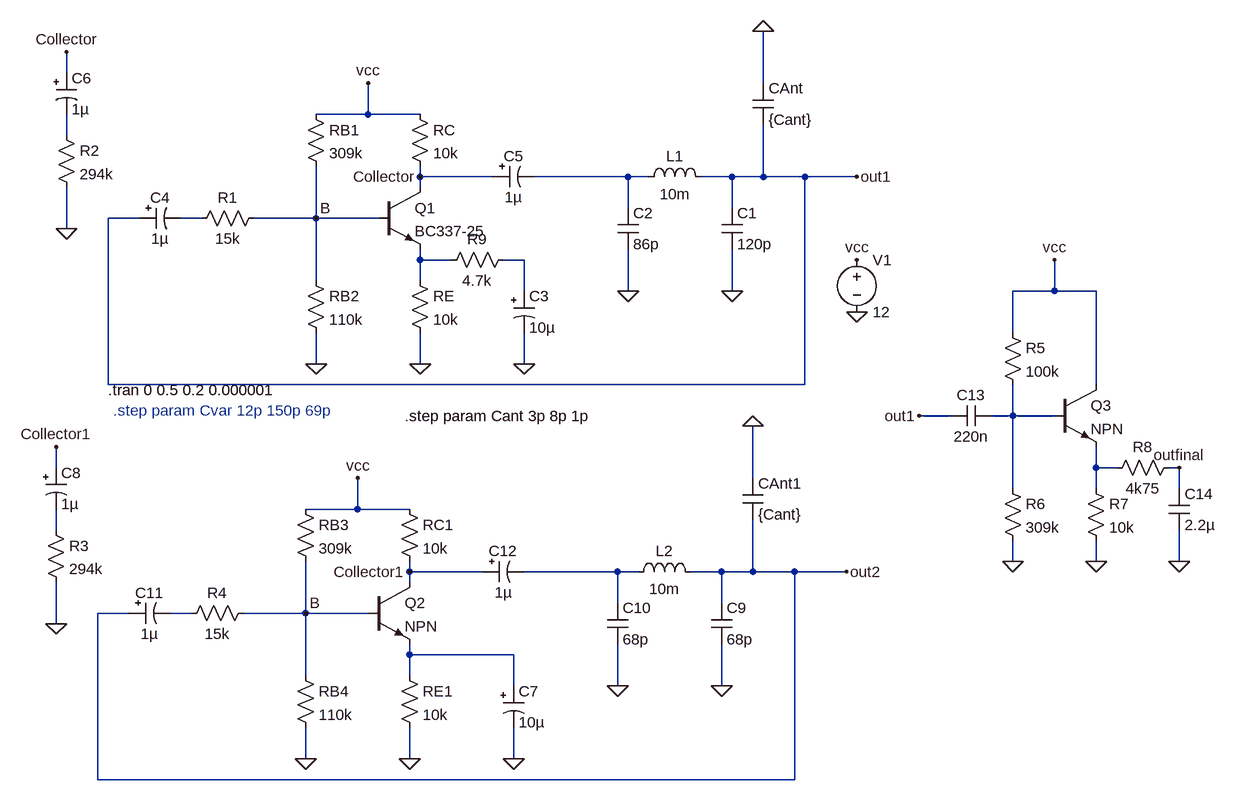
[diagram p0: schematic OscillatorExam.asc]
OscillatorExam.asc, the LTspice schematic file:
Version 4
SHEET 1 1408 1044
WIRE -528 -48 -528 -80
WIRE 544 -32 544 -112
WIRE -64 16 -64 -32
WIRE -64 16 -144 16
WIRE 16 16 -64 16
WIRE -528 48 -528 16
WIRE 16 112 16 96
WIRE 128 112 16 112
WIRE 336 112 192 112
WIRE 368 112 336 112
WIRE 496 112 448 112
WIRE 544 112 544 32
WIRE 544 112 496 112
WIRE 608 112 544 112
WIRE 688 112 608 112
WIRE 16 128 16 112
WIRE 336 160 336 112
WIRE 496 160 496 112
WIRE -416 176 -464 176
WIRE -320 176 -352 176
WIRE -144 176 -144 96
WIRE -144 176 -240 176
WIRE -48 176 -144 176
WIRE -528 192 -528 128
WIRE 16 240 16 224
WIRE 64 240 16 240
WIRE 176 240 144 240
WIRE -144 272 -144 176
WIRE 16 272 16 240
WIRE 176 288 176 240
WIRE 336 288 336 224
WIRE 496 288 496 224
WIRE 992 288 992 240
WIRE 992 288 928 288
WIRE 1056 288 992 288
WIRE 928 352 928 288
WIRE -144 400 -144 352
WIRE 16 400 16 352
WIRE 176 400 176 352
WIRE -464 432 -464 176
WIRE 608 432 608 112
WIRE 608 432 -464 432
WIRE 1056 432 1056 288
WIRE 832 480 784 480
WIRE 928 480 928 432
WIRE 928 480 896 480
WIRE 992 480 928 480
WIRE -544 560 -544 528
WIRE 1056 560 1056 528
WIRE 1088 560 1056 560
WIRE 1184 560 1168 560
WIRE 528 576 528 496
WIRE 928 592 928 480
WIRE 1056 592 1056 560
WIRE 1184 592 1184 560
WIRE -80 624 -80 576
WIRE -80 624 -160 624
WIRE 0 624 -80 624
WIRE -544 656 -544 624
WIRE 928 704 928 672
WIRE 1056 704 1056 672
WIRE 1184 704 1184 656
WIRE 0 720 0 704
WIRE 112 720 0 720
WIRE 320 720 176 720
WIRE 352 720 320 720
WIRE 480 720 432 720
WIRE 528 720 528 640
WIRE 528 720 480 720
WIRE 592 720 528 720
WIRE 672 720 592 720
WIRE 0 736 0 720
WIRE 320 768 320 720
WIRE 480 768 480 720
WIRE -432 784 -480 784
WIRE -336 784 -368 784
WIRE -160 784 -160 704
WIRE -160 784 -256 784
WIRE -64 784 -160 784
WIRE -544 800 -544 736
WIRE 0 848 0 832
WIRE 160 848 0 848
WIRE -160 880 -160 784
WIRE 0 880 0 848
WIRE 160 896 160 848
WIRE 320 896 320 832
WIRE 480 896 480 832
WIRE -160 1008 -160 960
WIRE 0 1008 0 960
WIRE 160 1008 160 960
WIRE -480 1040 -480 784
WIRE 592 1040 592 720
WIRE 592 1040 -480 1040
FLAG -64 -32 vcc
FLAG 688 240 vcc
FLAG 688 320 0
FLAG 176 400 0
FLAG 16 400 0
FLAG -144 400 0
FLAG 16 112 Collector
FLAG -528 192 0
FLAG -144 176 B
FLAG 496 288 0
FLAG 336 288 0
FLAG 688 112 out1
FLAG 544 -112 0
FLAG -528 -80 Collector
FLAG -80 576 vcc
FLAG 160 1008 0
FLAG 0 1008 0
FLAG -160 1008 0
FLAG 0 720 Collector1
FLAG -544 800 0
FLAG -160 784 B
FLAG 480 896 0
FLAG 320 896 0
FLAG 672 720 out2
FLAG 528 496 0
FLAG -544 528 Collector1
FLAG 992 240 vcc
FLAG 928 704 0
FLAG 1056 704 0
FLAG 1184 704 0
FLAG 784 480 out1
FLAG 1184 560 outfinal
SYMBOL res -160 0 R0
SYMATTR InstName RB1
SYMATTR Value 309k
SYMBOL res 0 0 R0
SYMATTR InstName RC
SYMATTR Value 10k
SYMBOL res 0 256 R0
SYMATTR InstName RE
SYMATTR Value 10k
SYMBOL res -160 256 R0
SYMATTR InstName RB2
SYMATTR Value 110k
SYMBOL polcap 160 288 R0
SYMATTR InstName C3
SYMATTR Value 10µ
SYMBOL voltage 688 224 R0
WINDOW 123 0 0 Left 0
WINDOW 39 0 0 Left 0
SYMATTR InstName V1
SYMATTR Value 12
SYMBOL polcap -544 -48 R0
SYMATTR InstName C6
SYMATTR Value 1µ
SYMBOL res -544 32 R0
SYMATTR InstName R2
SYMATTR Value 294k
SYMBOL npn -48 128 R0
SYMATTR InstName Q1
SYMATTR Value BC337-25
SYMBOL ind 464 128 M270
WINDOW 0 32 56 VTop 2
WINDOW 3 5 56 VBottom 2
SYMATTR InstName L1
SYMATTR Value 10m
SYMBOL cap 480 160 R0
SYMATTR InstName C1
SYMATTR Value 120p
SYMBOL cap 320 160 R0
SYMATTR InstName C2
SYMATTR Value 86p
SYMBOL cap 528 -32 R0
SYMATTR InstName CAnt
SYMATTR Value {Cant}
SYMBOL polcap -416 160 M90
WINDOW 0 0 32 VBottom 2
WINDOW 3 32 32 VTop 2
SYMATTR InstName C4
SYMATTR Value 1µ
SYMBOL polcap 128 96 M90
WINDOW 0 0 32 VBottom 2
WINDOW 3 32 32 VTop 2
SYMATTR InstName C5
SYMATTR Value 1µ
SYMBOL res -224 160 R90
WINDOW 0 0 56 VBottom 2
WINDOW 3 32 56 VTop 2
SYMATTR InstName R1
SYMATTR Value 15k
SYMBOL res -176 608 R0
SYMATTR InstName RB3
SYMATTR Value 309k
SYMBOL res -16 608 R0
SYMATTR InstName RC1
SYMATTR Value 10k
SYMBOL res -16 864 R0
SYMATTR InstName RE1
SYMATTR Value 10k
SYMBOL res -176 864 R0
SYMATTR InstName RB4
SYMATTR Value 110k
SYMBOL polcap 144 896 R0
SYMATTR InstName C7
SYMATTR Value 10µ
SYMBOL polcap -560 560 R0
SYMATTR InstName C8
SYMATTR Value 1µ
SYMBOL res -560 640 R0
SYMATTR InstName R3
SYMATTR Value 294k
SYMBOL ind 448 736 M270
WINDOW 0 32 56 VTop 2
WINDOW 3 5 56 VBottom 2
SYMATTR InstName L2
SYMATTR Value 10m
SYMBOL cap 464 768 R0
SYMATTR InstName C9
SYMATTR Value 68p
SYMBOL cap 304 768 R0
SYMATTR InstName C10
SYMATTR Value 68p
SYMBOL cap 512 576 R0
SYMATTR InstName CAnt1
SYMATTR Value {Cant}
SYMBOL polcap -432 768 M90
WINDOW 0 0 32 VBottom 2
WINDOW 3 32 32 VTop 2
SYMATTR InstName C11
SYMATTR Value 1µ
SYMBOL polcap 112 704 M90
WINDOW 0 0 32 VBottom 2
WINDOW 3 32 32 VTop 2
SYMATTR InstName C12
SYMATTR Value 1µ
SYMBOL res -240 768 R90
WINDOW 0 0 56 VBottom 2
WINDOW 3 32 56 VTop 2
SYMATTR InstName R4
SYMATTR Value 15k
SYMBOL npn -64 736 R0
SYMATTR InstName Q2
SYMBOL npn 992 432 R0
SYMATTR InstName Q3
SYMBOL cap 896 464 R90
WINDOW 0 0 32 VBottom 2
WINDOW 3 32 32 VTop 2
SYMATTR InstName C13
SYMATTR Value 220n
SYMBOL res 912 336 R0
SYMATTR InstName R5
SYMATTR Value 100k
SYMBOL res 912 576 R0
SYMATTR InstName R6
SYMATTR Value 309k
SYMBOL res 1040 576 R0
SYMATTR InstName R7
SYMATTR Value 10k
SYMBOL res 160 224 R90
WINDOW 0 0 56 VBottom 2
WINDOW 3 32 56 VTop 2
SYMATTR InstName R9
SYMATTR Value 4.7k
SYMBOL cap 1168 592 R0
SYMATTR InstName C14
SYMATTR Value 2.2µ
SYMBOL res 1184 544 R90
WINDOW 0 0 56 VBottom 2
WINDOW 3 32 56 VTop 2
SYMATTR InstName R8
SYMATTR Value 4k75
TEXT -464 440 Left 2 !.tran 0 0.5 0.2 0.000001
TEXT -456 472 Left 2 ;.step param Cvar 12p 150p 69p
TEXT -8 480 Left 2 !.step param Cant 3p 8p 1p

The netlist it stands for:
* OscillatorExam.asc
RB1 vcc B 309k
RC vcc Collector 10k
RE N004 0 10k
RB2 B 0 110k
C3 N005 0 10µ
V1 vcc 0 12
C6 Collector N001 1µ
R2 N001 0 294k
Q1 Collector B N004 0 BC337-25
L1 out1 N002 10m
C1 out1 0 120p
C2 N002 0 86p
CAnt 0 out1 {Cant}
C4 out1 N003 1µ
C5 Collector N002 1µ
R1 B N003 15k
RB3 vcc B 309k
RC1 vcc Collector1 10k
RE1 N011 0 10k
RB4 B 0 110k
C7 N011 0 10µ
C8 Collector1 N008 1µ
R3 N008 0 294k
L2 out2 N009 10m
C9 out2 0 68p
C10 N009 0 68p
CAnt1 0 out2 {Cant}
C11 out2 N010 1µ
C12 Collector1 N009 1µ
R4 B N010 15k
Q2 Collector1 B N011 0 NPN
Q3 vcc N006 N007 0 NPN
C13 N006 out1 220n
R5 vcc N006 100k
R6 N006 0 309k
R7 N007 0 10k
R9 N005 N004 4.7k
C14 outfinal 0 2.2µ
R8 outfinal N007 4k75
.model NPN NPN
.model PNP PNP
.lib standard.bjt
.tran 0 0.5 0.2 0.000001
* .step param Cvar 12p 150p 69p
.step param Cant 3p 8p 1p
.backanno
.end